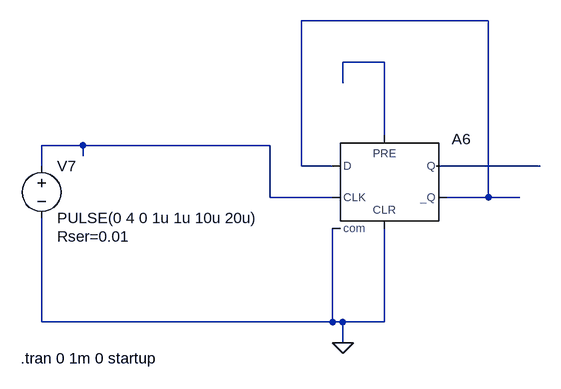
[diagram p0: schematic Dff-ron.asc]
Dff-ron.asc, the LTspice schematic file:
Version 4
SHEET 1 3624 4372
WIRE 1856 896 1568 896
WIRE 1696 960 1632 960
WIRE 1632 992 1632 960
WIRE 1696 1072 1696 960
WIRE 1232 1088 1168 1088
WIRE 1520 1088 1232 1088
WIRE 1232 1104 1232 1088
WIRE 1168 1120 1168 1088
WIRE 1568 1120 1568 896
WIRE 1616 1120 1568 1120
WIRE 1936 1120 1776 1120
WIRE 1520 1168 1520 1088
WIRE 1616 1168 1520 1168
WIRE 1856 1168 1856 896
WIRE 1856 1168 1792 1168
WIRE 1904 1168 1856 1168
WIRE 1168 1360 1168 1200
WIRE 1616 1360 1616 1216
WIRE 1616 1360 1168 1360
WIRE 1632 1360 1616 1360
WIRE 1696 1360 1696 1216
WIRE 1696 1360 1632 1360
WIRE 1632 1392 1632 1360
FLAG 1632 1392 0
SYMBOL Digital\\dflop 1696 1072 R0
WINDOW 3 0 0 Invisible 0
SYMATTR Value Ref=2.5
SYMATTR InstName A6
SYMATTR Value2 Vhigh=5  Vlow=0
SYMATTR SpiceLine Td=2n Trise=10n Tfall=10n
SYMATTR SpiceLine2 tripdt=5n
SYMBOL voltage 1168 1104 R0
WINDOW 123 0 0 Left 0
WINDOW 39 24 124 Left 2
SYMATTR SpiceLine Rser=0.01
SYMATTR InstName V7
SYMATTR Value PULSE(0 4 0 1u 1u 10u 20u)
TEXT 1136 1416 Left 2 !.tran 0 1m 0 startup

The netlist it stands for:
* Dff-ron.asc
A6 N001 0 N003 N002 0 N001 N004 0 DFLOP Ref=2.5 Vhigh=5  Vlow=0 Td=2n Trise=10n Tfall=10n tripdt=5n
V7 N003 0 PULSE(0 4 0 1u 1u 10u 20u) Rser=0.01
.tran 0 1m 0 startup
.backanno
.end